# Altium schematic sheet JFET.SchDoc: JFET
size A; DocumentNumber: 1; SheetNumber: 1; SheetTotal: 1
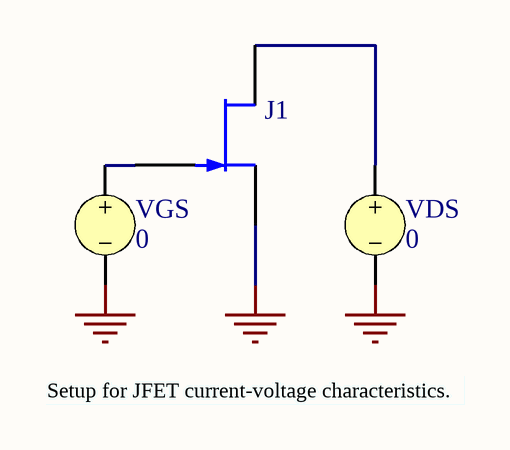
[diagram p0: JFET.SchDoc]

## Parts
J1  NE38018-T1  [SOT343/P1.3]  (value not drawn)
VDS  value 0  (hidden comment: VSRC)
VGS  value 0  (hidden comment: VSRC)

## Nets
GND: J1.1(S) VDS.2 VGS.2
NetJ1_2: J1.2(G) VGS.1
NetJ1_4: J1.4(D) VDS.1

## Notes on the sheet
- Setup for JFET current-voltage characteristics.
- Title
- Size:
- Date:
- A
- Number:
- Time:
- Revision:
- Sheet
- of
- File:

## Library data of the parts
J1 = NE38018-T1: N-channel junction fet
VDS VGS = VSRC: Voltage Source; Manufacturer: Generic Components; Class: Simulation; Note: PCB Footprint - Not required; Published: 8/06/2000; SubClass: Voltage Source